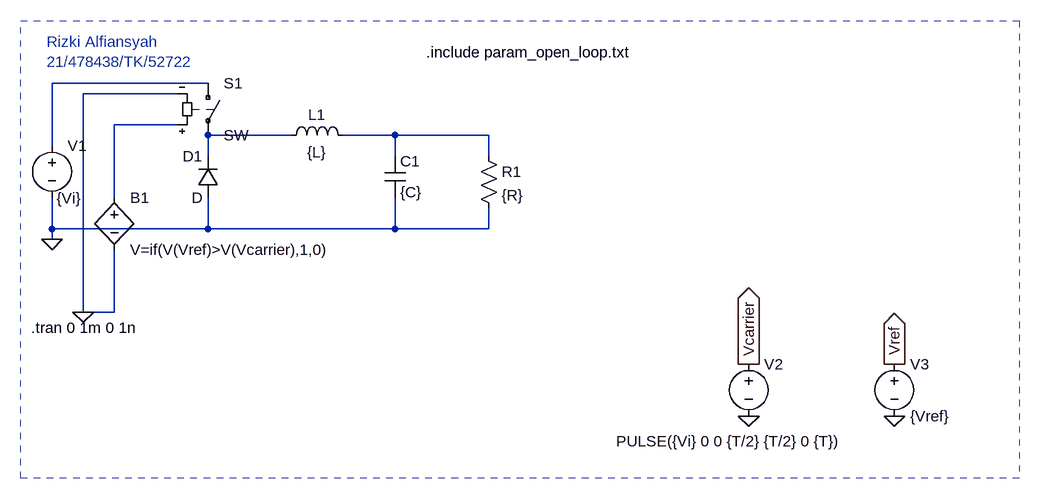
[diagram p0: schematic Open-Loop_Buck-Converter.asc]
Open-Loop_Buck-Converter.asc, the LTspice schematic file:
Version 4
SHEET 1 1588 712
WIRE 336 32 96 32
WIRE 288 48 144 48
WIRE 288 96 192 96
WIRE 464 112 336 112
WIRE 624 112 544 112
WIRE 768 112 624 112
WIRE 96 128 96 32
WIRE 336 144 336 112
WIRE 624 144 624 112
WIRE 768 144 768 112
WIRE 192 208 192 96
WIRE 96 256 96 208
WIRE 336 256 336 208
WIRE 336 256 96 256
WIRE 624 256 624 208
WIRE 624 256 336 256
WIRE 768 256 768 224
WIRE 768 256 624 256
WIRE 96 272 96 256
WIRE 144 384 144 48
WIRE 192 384 192 288
WIRE 192 384 144 384
FLAG 144 384 0
FLAG 96 272 0
FLAG 1392 544 0
FLAG 1168 544 0
FLAG 1168 464 Vcarrier
IOPIN 1168 464 Out
FLAG 1392 464 Vref
IOPIN 1392 464 Out
SYMBOL voltage 96 112 R0
WINDOW 3 7 97 Left 2
WINDOW 123 0 0 Left 0
WINDOW 39 0 0 Left 0
SYMATTR Value {Vi}
SYMATTR InstName V1
SYMBOL diode 352 208 R180
WINDOW 0 24 64 Left 2
WINDOW 3 24 0 Left 2
SYMATTR InstName D1
SYMBOL cap 608 144 R0
SYMATTR InstName C1
SYMATTR Value {C}
SYMBOL res 752 128 R0
SYMATTR InstName R1
SYMATTR Value {R}
SYMBOL ind 448 128 R270
WINDOW 0 32 56 VTop 2
WINDOW 3 5 56 VBottom 2
SYMATTR InstName L1
SYMATTR Value {L}
SYMBOL voltage 1168 448 R0
WINDOW 123 0 0 Left 0
WINDOW 39 0 0 Left 0
WINDOW 3 -204 135 Left 2
SYMATTR Value PULSE({Vi} 0 0 {T/2} {T/2} 0 {T})
SYMATTR InstName V2
SYMBOL sw 336 16 R0
SYMATTR InstName S1
SYMBOL voltage 1392 448 R0
WINDOW 123 0 0 Left 0
WINDOW 39 0 0 Left 0
SYMATTR InstName V3
SYMATTR Value {Vref}
SYMBOL bv 192 192 R0
SYMATTR InstName B1
SYMATTR Value V=if(V(Vref)>V(Vcarrier),1,0)
TEXT 64 408 Left 2 !.tran 0 1m 0 1n
TEXT 672 -16 Left 2 !.include param_open_loop.txt
TEXT 88 -32 Left 2 ;Rizki Alfiansyah\n21/478438/TK/52722
RECTANGLE Normal 1584 640 48 -64 2

The netlist it stands for:
* Open-Loop_Buck-Converter.asc
V1 N001 0 {Vi}
D1 0 N003 D
C1 N004 0 {C}
R1 N004 0 {R}
L1 N003 N004 {L}
V2 Vcarrier 0 PULSE({Vi} 0 0 {T/2} {T/2} 0 {T})
S1 N001 N003 N002 0 SW
V3 Vref 0 {Vref}
B1 N002 0 V=if(V(Vref)>V(Vcarrier),1,0)
.model D D
.lib standard.dio
.tran 0 1m 0 1n
.include param_open_loop.txt
* Rizki Alfiansyah
* 21/478438/TK/52722
.backanno
.end